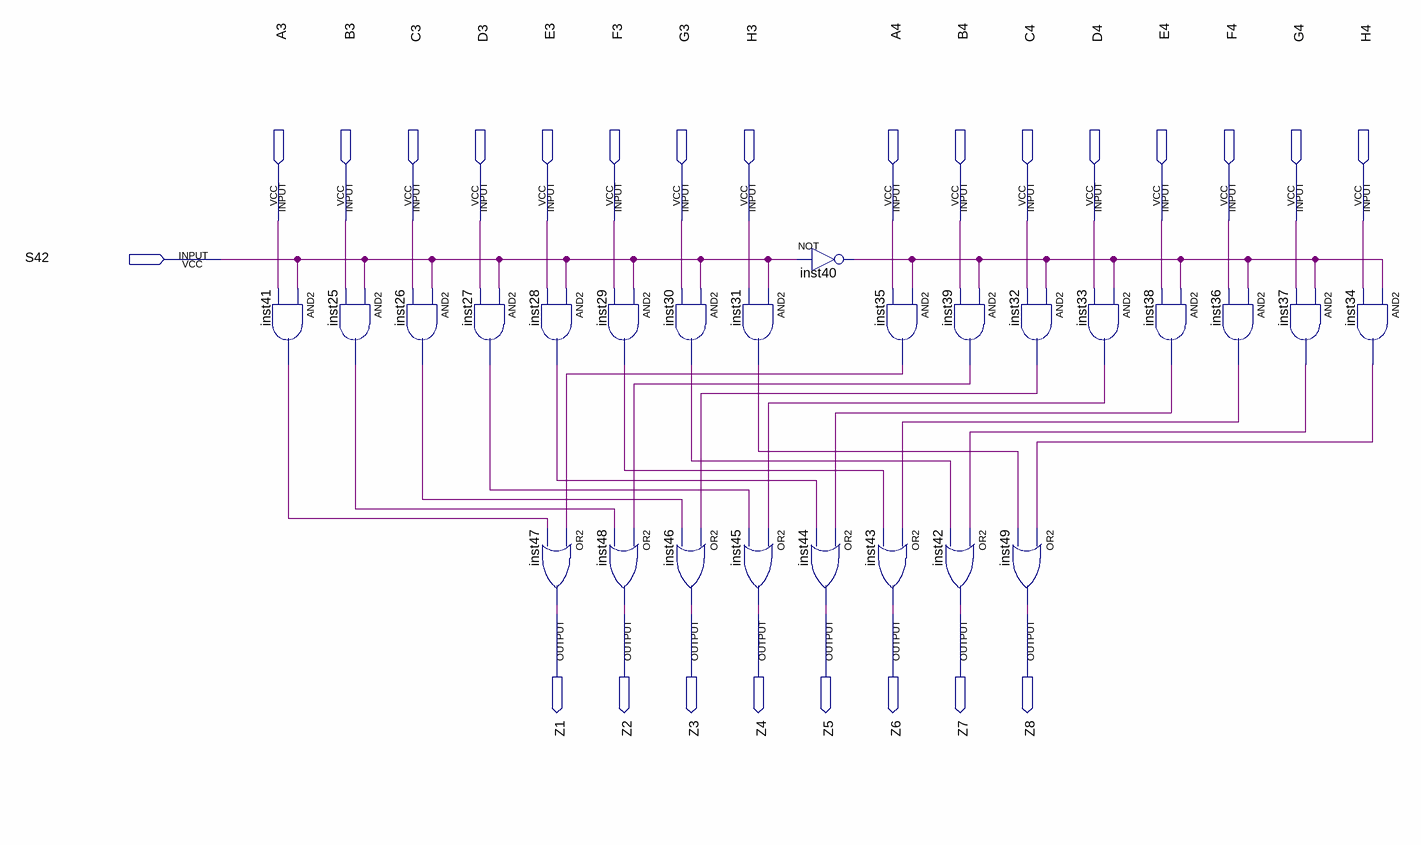
[diagram p0: schematic sheet]
// Quartus schematic Mux8x1.bdf as structural Verilog: 25 symbols, 25 pins
module Mux8x1 (
  input  A3,
  input  B3,
  input  C3,
  input  D3,
  input  E3,
  input  F3,
  input  G3,
  input  H3,
  input  A4,
  input  B4,
  input  C4,
  input  D4,
  input  E4,
  input  F4,
  input  G4,
  input  H4,
  input  S42,
  output Z1,
  output Z2,
  output Z3,
  output Z4,
  output Z5,
  output Z6,
  output Z7,
  output Z8
);

  wire inst25_out, inst26_out, inst27_out, inst28_out, inst29_out, inst30_out, inst31_out, inst32_out,
       inst33_out, inst34_out, inst35_out, inst36_out, inst37_out, inst38_out, inst39_out, inst40_out,
       inst41_out;

  and inst41 (inst41_out, S42, A3);
  and inst25 (inst25_out, S42, B3);
  and inst26 (inst26_out, S42, C3);
  and inst27 (inst27_out, S42, D3);
  and inst28 (inst28_out, S42, E3);
  or inst47 (Z1, inst35_out, inst41_out);
  and inst29 (inst29_out, S42, F3);
  and inst30 (inst30_out, S42, G3);
  or inst46 (Z3, inst32_out, inst26_out);
  or inst48 (Z2, inst39_out, inst25_out);
  and inst31 (inst31_out, S42, H3);
  or inst45 (Z4, inst33_out, inst27_out);
  not inst40 (inst40_out, S42);
  or inst44 (Z5, inst38_out, inst28_out);
  and inst35 (inst35_out, inst40_out, A4);
  or inst43 (Z6, inst36_out, inst29_out);
  and inst39 (inst39_out, inst40_out, B4);
  or inst42 (Z7, inst37_out, inst30_out);
  and inst32 (inst32_out, inst40_out, C4);
  or inst49 (Z8, inst34_out, inst31_out);
  and inst33 (inst33_out, inst40_out, D4);
  and inst38 (inst38_out, inst40_out, E4);
  and inst36 (inst36_out, inst40_out, F4);
  and inst37 (inst37_out, inst40_out, G4);
  and inst34 (inst34_out, inst40_out, H4);
endmodule
